# Altium schematic sheet Charger.SchDoc
size B; DocumentNumber: 9; SheetNumber: 9; SheetTotal: 9
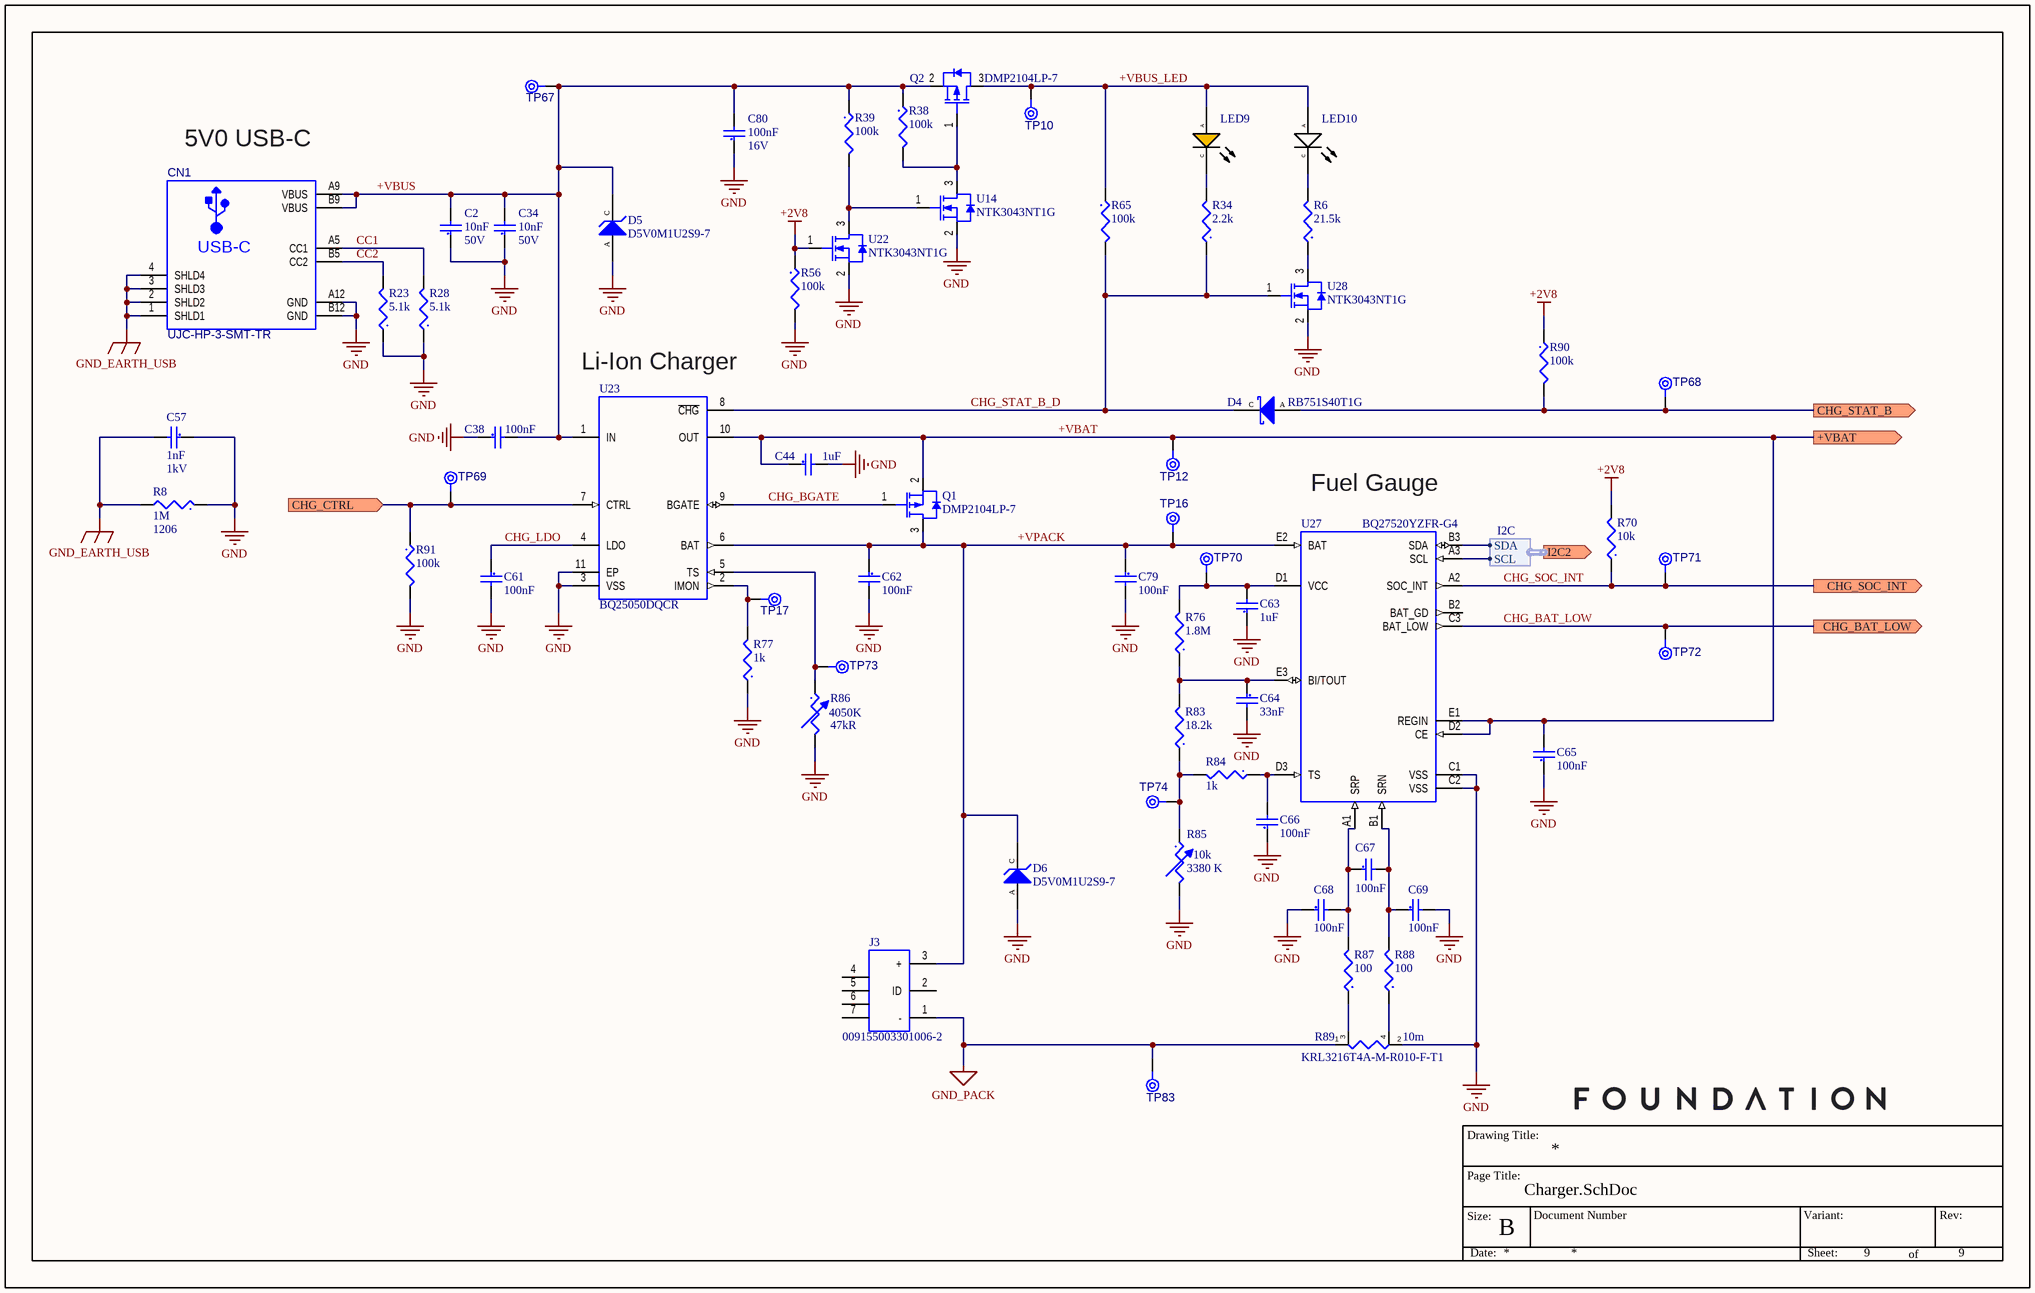
[diagram p0: Charger.SchDoc]

## Parts
C2  Capacitance: 10nF  Voltage: 50V  [CAPC0402(1005)55_L]  (hidden comment: CAP CER 0.01uF 50V 10% X7R 0402)
C34  Capacitance: 10nF  Voltage: 50V  [CAPC0402(1005)55_L]  (hidden comment: CAP CER 0.01uF 50V 10% X7R 0402)
C38  Capacitance: 100nF  [CAPC0402(1005)55_L]  (hidden comment: CAP CER 0.1uF 16V 10% X7R 0402)
C44  Capacitance: 1uF  [CAPC0402(1005)55_L]  (hidden comment: CAP CER 1uF 25V 10% X5R 0402)
C57  Capacitance: 1nF  Voltage Rating (DC): 1kV  [CAPC0805(2012)145_N]  (hidden comment: CAP CER 1000pF 1000V 10% X7R 0805)
C61  Capacitance: 100nF  [CAPC0402(1005)55_L]  (hidden comment: CAP CER 0.1uF 16V 10% X7R 0402)
C62  Capacitance: 100nF  [CAPC0402(1005)55_L]  (hidden comment: CAP CER 0.1uF 16V 10% X7R 0402)
C63  Capacitance: 1uF  [CAPC0402(1005)55_L]  (hidden comment: CAP CER 1uF 25V 10% X5R 0402)
C64  Capacitance: 33nF  [CAPC0402(1005)55_L]  (hidden comment: CAP CER 0.033uF 25V 10% X7R 0402)
C65  Capacitance: 100nF  [CAPC0402(1005)55_L]  (hidden comment: CAP CER 0.1uF 16V 10% X7R 0402)
C66  Capacitance: 100nF  [CAPC0402(1005)55_L]  (hidden comment: CAP CER 0.1uF 16V 10% X7R 0402)
C67  Capacitance: 100nF  [CAPC0402(1005)55_L]  (hidden comment: CAP CER 0.1uF 16V 10% X7R 0402)
C68  Capacitance: 100nF  [CAPC0402(1005)55_L]  (hidden comment: CAP CER 0.1uF 16V 10% X7R 0402)
C69  Capacitance: 100nF  [CAPC0402(1005)55_L]  (hidden comment: CAP CER 0.1uF 16V 10% X7R 0402)
C79  Capacitance: 100nF  [CAPC0402(1005)55_L]  (hidden comment: CAP CER 0.1uF 16V 10% X7R 0402)
C80  Capacitance: 100nF  Voltage: 16V  [CAPC0402(1005)55_L]  (hidden comment: CAP CER 0.1uF 16V 10% X7R 0402)
CN1  UJC-HP-3-SMT-TR  [CUI - UJC-HP-3-SMT_V]
D4  RB751S40T1G  [ON - SOD-523_V]
D5  D5V0M1U2S9-7  [DIOD - SOD-923_V]
D6  D5V0M1U2S9-7  [DIOD - SOD-923_V]
J3  009155003301006-2  [AVX - 009155003301006_V]
LED9  IN-S63AT5A  [LEDC0603(1608)65_L]  (value not drawn)
LED10  IN-S63AT5UW  [LEDC0603(1608)65_L]  (value not drawn)
Q1  DMP2104LP-7  [DIOD - XDFN-3_V]
Q2  DMP2104LP-7  [DIOD - XDFN-3_V]
R6  Resistance: 21.5k  [RESC0402(1005)_L]  (hidden comment: RES 21.5K 1/16W 1% 0402)
R8  Resistance: 1M  Case Code (Imperial): 1206  [RESC1206(3216)_L]  (hidden comment: RES 1.0M 1/4W 5% 1206)
R23  Resistance: 5.1k  [RESC0402(1005)_L]  (hidden comment: RES 5.1K 1/16W 1% 0402)
R28  Resistance: 5.1k  [RESC0402(1005)_L]  (hidden comment: RES 5.1K 1/16W 1% 0402)
R34  Resistance: 2.2k  [RESC0402(1005)_L]  (hidden comment: RES 2.2K 1/16W 1% 0402)
R38  Resistance: 100k  [RESC0402(1005)_L]  (hidden comment: RES 100K 1/16W 1% 0402)
R39  Resistance: 100k  [RESC0402(1005)_L]  (hidden comment: RES 100K 1/16W 1% 0402)
R56  Resistance: 100k  [RESC0402(1005)_L]  (hidden comment: RES 100K 1/16W 1% 0402)
R65  Resistance: 100k  [RESC0402(1005)_L]  (hidden comment: RES 100K 1/16W 1% 0402)
R70  Resistance: 10k  [RESC0402(1005)_L]  (hidden comment: RES 10K 1/16W 1% 0402)
R76  Resistance: 1.8M  [RESC0402(1005)_L]  (hidden comment: RES 1.8M 1/16W 1% 0402)
R77  Resistance: 1k  [RESC0402(1005)_L]  (hidden comment: RES 1.0K 1/16W 1% 0402)
R83  Resistance: 18.2k  [RESC0402(1005)_L]  (hidden comment: RES 18.2K 1/16W 1% 0402)
R84  Resistance: 1k  [RESC0402(1005)_L]  (hidden comment: RES 1.0K 1/16W 1% 0402)
R85  Resistance: 10k  B Constant [25/50°C]: 3380 K  [RESC0402(1005)_L]  (hidden comment: NTCG103JF103FT1)
R86  Resistance: 47kR  B Constant [25/50°C]: 4050K  [RESC0402(1005)_L]  (hidden comment: NCP15WB473F03RC)
R87  Resistance: 100  [RESC0402(1005)_L]  (hidden comment: RES 100 OHM 1/16W 1% 0402)
R88  Resistance: 100  [RESC0402(1005)_L]  (hidden comment: RES 100 OHM 1/16W 1% 0402)
R89  KRL3216T4A-M-R010-F-T1  Resistance: 10m  [Susumu - KRL3216T4A_V]
R90  Resistance: 100k  [RESC0402(1005)_L]  (hidden comment: RES 100K 1/16W 1% 0402)
R91  Resistance: 100k  [RESC0402(1005)_L]  (hidden comment: RES 100K 1/16W 1% 0402)
TP10  TPAD8R  [TP08R]  (value not drawn)  (no BOM)
TP12  TPAD8R  [TP08R]  (value not drawn)  (no BOM)
TP16  TPAD8R  [TP08R]  (value not drawn)  (no BOM)
TP17  TPAD8R  [TP08R]  (value not drawn)  (no BOM)
TP67  TPAD8R  [TP08R]  (value not drawn)  (no BOM)
TP68  TPAD8R  [TP08R]  (value not drawn)  (no BOM)
TP69  TPAD8R  [TP08R]  (value not drawn)  (no BOM)
TP70  TPAD8R  [TP08R]  (value not drawn)  (no BOM)
TP71  TPAD8R  [TP08R]  (value not drawn)  (no BOM)
TP72  TPAD8R  [TP08R]  (value not drawn)  (no BOM)
TP73  TPAD8R  [TP08R]  (value not drawn)  (no BOM)
TP74  TPAD8R  [TP08R]  (value not drawn)  (no BOM)
TP83  TPAD8R  [TP08R]  (value not drawn)  (no BOM)
U14  NTK3043NT1G  [SOT-723-3(40)_N]
U22  NTK3043NT1G  [SOT-723-3(40)_N]
U23  BQ25050DQCR  [TI - WSON-DQC-10_V]
U27  BQ27520YZFR-G4  [TI - DSBGA-YZF-15_V]
U28  NTK3043NT1G  [SOT-723-3(40)_N]

## Ports
+VBAT (out), CHG_BAT_LOW (out), CHG_CTRL (in), CHG_SOC_INT (out), CHG_STAT_B (out), I2C2 (out, harness I2C)

## Harnesses
I2C: SDA, SCL

## Nets
+2V8: R56.1 R70.2 R90.1 U22.1(G)
GND: C2.1 C34.1 C38.1 C44.2 C57.1 C61.2 C62.2 C63.1 C64.2 C65.1 C66.1 C68.1 C69.2 C79.2 C80.1 CN1.A12(GND) CN1.B12(GND) D5.A D6.A R8.1 R23.1 R28.1 R56.2 R77.1 R85.2 R86.2 R89.2(I2) R91.2 U14.2(S) U22.2(S) U23.3(VSS) U23.11(EP) U27.C1(VSS) U27.C2(VSS) U28.2(S)
GND_EARTH_USB: C57.2 CN1.1(SHLD1) CN1.2(SHLD2) CN1.3(SHLD3) CN1.4(SHLD4) R8.2
GND_PACK: J3.1(-) R89.1(I1) TP83.1(TP)
+VBAT: C44.1 C65.2 Q1.2(SOURCE) TP12.1(TP) U23.10(OUT) U27.D2(CE) U27.E1(REGIN) ; port +VBAT
+VBUS: C2.2 C34.2 C38.2 C80.2 CN1.A9(VBUS) CN1.B9(VBUS) D5.C Q2.2(SOURCE) R38.1 R39.1 TP67.1(TP) U23.1(IN)
+VBUS_LED: LED9.A LED10.A Q2.3(DRAIN) R65.1 TP10.1(TP)
+VPACK: C62.1 C79.1 D6.C J3.3(+) Q1.3(DRAIN) TP16.1(TP) U23.6(BAT) U27.E2(BAT)
CC1: CN1.A5(CC1) R28.2
CC2: CN1.B5(CC2) R23.2
CHG_BAT_LOW: TP72.1(TP) U27.C3(BAT_LOW) ; port CHG_BAT_LOW
CHG_BGATE: Q1.1(GATE) U23.9(BGATE)
CHG_CTRL: R91.1 TP69.1(TP) U23.7(CTRL) ; port CHG_CTRL
CHG_LDO: C61.1 U23.4(LDO)
CHG_SOC_INT: R70.1 TP71.1(TP) U27.A2(SOC_INT) ; port CHG_SOC_INT
CHG_STAT_B: D4.A R90.2 TP68.1(TP) ; port CHG_STAT_B
CHG_STAT_B_D: D4.C R34.1 R65.2 U23.8(~{CHG}) U28.1(G)
NetC63_2: C63.2 R76.2 TP70.1(TP) U27.D1(VCC)
NetC64_1: C64.1 R76.1 R83.2 U27.E3(BI/TOUT)
NetC66_2: C66.2 R84.1 U27.D3(TS)
NetC67_1: C67.1 C68.2 R87.2 U27.A1(SRP)
NetC67_2: C67.2 C69.1 R88.2 U27.B1(SRN)
NetLED9_C: LED9.C R34.2
NetLED10_C: LED10.C R6.2
NetQ2_1: Q2.1(GATE) R38.2 U14.3(D)
NetR6_1: R6.1 U28.3(D)
NetR39_2: R39.2 U14.1(G) U22.3(D)
NetR77_2: R77.2 TP17.1(TP) U23.2(IMON)
NetR83_1: R83.1 R84.2 R85.1 TP74.1(TP)
NetR86_1: R86.1 TP73.1(TP) U23.5(TS)
NetR87_1: R87.1 R89.3(E1)
NetR88_1: R88.1 R89.4(E2)
NetU27_A3: U27.A3(SCL) ; port I2C2.SCL
NetU27_B3: U27.B3(SDA) ; port I2C2.SDA

Not connected (* = marked no-connect by the designer): J3 2(ID) 4 5 6 7; U27 B2(BAT_GD)

## Notes on the sheet
- (near CN1) 5V0 USB-C
- (near U23) Li-Ion Charger
- Fuel Gauge
- Drawing Title:
- Page Title:
- Size:
- B
- Document Number
- Variant:
- Rev:
- Date:
- Sheet:
- of
- (in symbol CMP-CON-0075-1) USB-C

## Library data of the parts
C2 C34 = CMP-CAP-00023-2: 10000pF ±10% 50V Ceramic Capacitor X7R 0402 (1005 Metric); Voltage Rating: 50V; Contact Plating: Tin,Matte; Packaging: Tape and Reel; Depth: 0.5mm; Mount: Surface Mount; Dielectric: X7R; Min Operating Temperature: -55°C; Case/Package: 0402; Tolerance: 10%; Dielectric Material: Ceramic; Termination: SMD/SMT; Radiation Hardening: No; Height: 0.5mm; Max Operating Temperature: 125°C; Length: 1mm
C38 C61 C62 C65-C69 C79 C80 = CMP-CAP-00002-2: 0.1µF ±10% 16V Ceramic Capacitor X7R 0402 (1005 Metric); Insulation Resistance: 10GR; Material: Ceramic; Tolerance: 10%; REACH SVHC: No SVHC; Radiation Hardening: No; Case Code (Metric): 1005; Height: 0.5mm; Depth: 0.5mm; Min Operating Temperature: -55°C; Max Operating Temperature: 125°C; Lead Free: Lead Free; Thickness: 0.022inch; Length: 1mm; Voltage Rating (DC): 16V; Dielectric Material: Ceramic; Packaging: Tape and Reel; Case/Package: 0402; Width: 0.5mm; Termination: SMD/SMT; Voltage Rating: 16V; Mount: Surface Mount; Case Code (Imperial): 0402; Package Quantity: 1; Dielectric: X7R; Number of Pins: 2
  C38 C61 C62 C65-C69 C79: Voltage: 16V
C44 C63 = CMP-CAP-00053-2: 1uF ±10% 25V Ceramic Capacitor X5R 0402 (1005 Metric); Number of Terminals/Pins: 2; Multilayer: Yes; Width: 0.5mm; Height: 0.6mm; Termination: Wraparound; Dielectric Material: Ceramic; Min Operating Temperature: -55°C; Mount: Surface Mount; Length: 1mm; Capacitor Type: Ceramic; Max Operating Temperature: 85°C; Packaging: Tape and Reel; Negative Tolerance: 10%; Package Style: SMTMeter; Package Shape: Rectangular; Size Code: 0402; Rated DC Voltage (URdc): 25V; Terminal Finish: Nickel; Positive Tolerance: 10%; JESD-609 Code: e3; Temperature Characteristics Code: X5R
C57 = CMP-CAP-00004-1: 1000pF ±10% 1000V (1kV) Ceramic Capacitor X7R 0805 (2012 Metric); Insulation Resistance: 100GR; Mount: Surface Mount; Width: 1.25mm; Voltage Rating: 1kV; Number of Pins: 2; Packaging: Tape and Reel; Package Quantity: 4000; Termination: SMD/SMT; Height: 1.3mm; Case Code (Metric): 2012; Depth: 1.25mm; Dielectric: X7R; Thickness: 0.051inch; Length: 2.01mm; Case Code (Imperial): 0805; Contact Plating: Nickel,Tin,Matte; Dissipation Factor: 10%; Tolerance: 10%; Case/Package: 0805; Min Operating Temperature: -55°C; REACH SVHC: No SVHC; Lead Free: Lead Free; Dielectric Material: Ceramic; Max Operating Temperature: 125°C
C64 = CMP-CAP-00072-1: 0.033µF ±10% 25V Ceramic Capacitor X7R 0402 (1005 Metric); Manufacturer Series: C0402C333K3RACTU; Multilayer: Yes; Number of Terminals/Pins: 2; Positive Tolerance: 10%; Width: 0.5mm; Mount: Surface Mount; Max Operating Temperature: 125°C; JESD-609 Code: e3; Termination: Wraparound; Min Operating Temperature: -55°C; Package Style: SMTMeter; Terminal Finish: Nickel; Length: 1mm; Rated DC Voltage (URdc): 25V; Series: C(SIZE)C(X7R); Size Code: 0402; Packaging: Tape and Reel; REACH SVHC: Yes; Package Shape: Rectangular; Negative Tolerance: 10%; Temperature Characteristics Code: X7R; Height: 0.5mm; RoHS Compliant: Yes; Capacitor Type: Ceramic; Dielectric Material: Ceramic
CN1 = CMP-CON-0075-1: USB-C (USB TYPE-C) - Receptacle Connector 24 (6+18 Dummy) Position Surface Mount, Right Angle; Through Hole; ComponentLink1Description: Datasheet; ComponentLink1URL: https://www.cuidevices.com/product/resource/ujc-hp-3-smt-tr.pdf
D4 = CMP-DIO-0007-1: Diode Schottky 30V 30mA (DC) Surface Mount SOD-523; Voltage Rating (DC): 40V; Peak Non-Repetitive Surge Current: 500mA; Peak Reverse Current: 500nA; Element Configuration: Single; Capacitance: 2.5pF; Power Dissipation: 200mW; Polarity: Standard; Forward Voltage: 370mV; Radiation Hardening: No; Min Operating Temperature: -55°C; Current Rating: 30mA; Forward Current: 30mA; Number of Pins: 2; Average Rectified Current: 30mA; Output Current: 30mA; Max Operating Temperature: 150°C; Width: 0.9mm; ComponentLink1Description: Datasheet; Length: 1.3mm; Max Surge Current: 500mA; Max Reverse Voltage (DC): 30V; REACH SVHC: No SVHC; Lead Free: Lead Free; Max Reverse Leakage Current: 500nA; Max Forward Surge Current (Ifsm): 500mA; Package Quantity: 1; ComponentLink1URL: https://www.onsemi.cn/PowerSolutions/document/RB751S40T1-D.PDF; Max Repetitive Reverse Voltage (Vrrm): 40V; Contact Plating: Tin,Matte; Case/Package: SOD-523-2; Height: 0.7mm; Packaging: Tape and Reel
D5 D6 = CMP-DIO-0013-1: 12V Clamp 9A (8/20µs) Ipp Tvs Diode Surface Mount SOD-923; Polarity: Unidirectional; Diode Element Material: SILICON; Min Breakdown Voltage: 6.2V; Number of Terminals/Pins: 2; Max Power Dissipation: 250mW; Package Body Material: Plastic; Diode Type: TRANS VOLTAGE SUPPRESSOR; Number of Elements: 1; Non-rep Peak Rev Power Dis-Max: 108W; Rep Pk Reverse Voltage-Max: 5.5V; RoHS Compliant: Yes; ComponentLink1Description: Datasheet; ComponentLink1URL: https://www.diodes.com/assets/Datasheets/D5V0M1U2S9.pdf; Technology: AVALANCHE; Package Shape: Rectangular; Surface Mount: Yes; JESD-30 Code: R-PDSO-F2; Package Style: SMALL OUTLINEMeter; Terminal Position: DUAL; Min Operating Temperature: -65°C; Max Operating Temperature: 150°C; REACH SVHC: Yes; Terminal Form: Flat
J3 = CMP-CON-0077-1: 3 Position Spring Battery Contact Connector Surface Mount, Right Angle; Manufacturer Series: 9155; MIL Conformance: No; Option: General Purpose; Connector Type: PCB; ComponentLink1URL: https://datasheets.avx.com/RightAngle3.0mmPictch_9155-300.pdf; JESD-609 Code: e3; IEC Conformance: No; REACH SVHC: Yes; DIN Conformance: No; ComponentLink1Description: Datasheet; Contact Finish - Mating: GOLD (16); RoHS Compliant: Yes; Contact Finish - Termination: PURE TIN
LED9 = CMP-007-00047-1: Amber 605nm LED Indication - Discrete 1.9V 0603 (1608 Metric); Forward Voltage: 1.9V; Colour: Amber; ComponentLink1Description: Datasheet; ComponentLink1URL: http://www.inolux-corp.com/datasheet/SMDLED/Mono%20Color%20Top%20View/IN-S63AT%20Series_V1.1.pdf
LED10 = CMP-007-00044-5: White - LED Indication - Discrete 3V 0603 (1608 Metric); Test Current: 5mA; Viewing Angle: 120°; Lens Transparency: Clear; Lens Style: Flat; Luminous Intensity: 900mcd; Lens Size: 0.8mm; Case/Package: 0603; Forward Voltage: 3V; Mount: Surface Mount; Length: 1.6mm; Height: 0.4mm; Width: 0.8mm; Color: White; Packaging: Tape and Reel; Lens Color: Clear; Case Code (Imperial): 0603; Case Code (Metric): 1608; ComponentLink1URL: http://www.inolux-corp.com/datasheet/SMDLED/Mono%20Color%20Top%20View/IN-S63AT%20Series_V1.1.pdf; ComponentLink1Description: Datasheet
Q1 Q2 = CMP-TRNST-0008-1: P-Channel 20 V 1.5A (Ta) 500mW (Ta) Surface Mount 3-DFN1411 (1.4x1.1); Transistor Application: SWITCHING; Number of Elements: 1; Transistor Element Material: SILICON; Operating Mode: ENHANCEMENT MODE; Package Body Material: Plastic; FET Technology: METAL-OXIDE SEMICONDUCTOR; Drain-source On Resistance-Max: 150mR; Time @ Peak Reflow Temperature-Max (s): 40s; Additional Feature: HIGH RELIABILITY; DS Breakdown Voltage-Min: 20V; Number of Terminals/Pins: 3; Case Connection: DRAIN; Qualification Status: Not Qualified; Max Operating Temperature: 150°C; ComponentLink1Description: Datasheet; RoHS Compliant: Yes; ComponentLink1URL: https://www.diodes.com/assets/Datasheets/ds31091.pdf; Terminal Position: BOTTOM; Surface Mount: Yes; Package Style: CHIP CARRIERMeter; JESD-609 Code: e4; Moisture Sensitivity Level: 1; Terminal Form: No Lead; Drain Current-Max (Abs) (ID): 1.5A; Power Dissipation-Max (Abs): 500mW; Polarity/Channel Type: P-CHANNEL; Drain Current-Max (ID): 1.5A; Terminal Finish: Nickel; Peak Reflow Temperature (Cel): 260°C; REACH SVHC: Yes; Package Shape: Rectangular
R6 = CMP-RES-00073-1: 21.5 kOhms ±1% 0.063W, 1/16W Chip Resistor 0402 (1005 Metric); Temperature Coefficient: 100ppm/°C; Voltage Rating: 50V; Number of Terminals/Pins: 2; Reference Standard: AEC-Q200; Rated Temperature: 70°C; Package Height: 0.35mm; Rated Power Dissipation (P): 63mW; Package Width: 0.5mm; Package Length: 1mm; Termination: Wraparound; Max Operating Temperature: 155°C; Min Operating Temperature: -55°C; Packaging: Tape and Reel; Tolerance: 1%; Mount: Surface Mount; Working Voltage: 50V; Construction: Chip; Resistor Type: FIXED RESISTOR; Technology: METAL GLAZE/THICK FILM; JESD-609 Code: e3; Size Code: 0402; Terminal Finish: Nickel; Package Style: SMTMeter; Package Shape: Rectangular
R8 = CMP-RES-00004-3: 1 MOhms ±5% 0.25W, 1/4W Chip Resistor 1206 (3216 Metric) Moisture Resistant Thick Film; Power Rating: 250mW; Temperature Coefficient: 200ppm/°C; Voltage Rating: 200V; Mount: Surface Mount; Radiation Hardening: No; Tolerance: 5%; Military Standard: Not; Termination: SMD/SMT; Case Code (Metric): 3216; Depth: 1.6mm; Case/Package: 1206; REACH SVHC: No SVHC; Height: 0.6mm; Max Operating Temperature: 155°C; Package Quantity: 5000; Thickness: 610um; Min Operating Temperature: -55°C; Voltage Rating (DC): 200V; Length: 3.2mm; Composition: Thick Film; Width: 1.6mm; Packaging: Tape and Reel; Contact Plating: Tin
R23 R28 = CMP-RES-00060-1: 5.1 kOhms ±1% 0.063W, 1/16W Chip Resistor 0402 (1005 Metric); Voltage Rating (DC): 50V; Temperature Coefficient: 100ppm/°C; Power Rating: 63mW; Min Operating Temperature: -55°C; Packaging: Tape and Reel; Package Quantity: 10; REACH SVHC: Unknown; Number of Terminations: 2; Termination: SMD/SMT; Composition: Thick Film; Length: 1mm; Case Code (Imperial): 0402; Weight: 2.3E-05oz; Lead Free: Lead Free; Max Operating Temperature: 155°C; Voltage Rating: 50V; Contact Plating: Tin; Radiation Hardening: No; Case Code (Metric): 1005; Height: 0.35mm; Tolerance: 1%; Depth: 0.5mm; Military Standard: Not; Width: 0.02inch; Max Power Dissipation: 63mW; Case/Package: 0402; Features: Automotive AEC-Q200
R34 = CMP-RES-00049-1: 2.2 kOhms ±1% 0.063W, 1/16W Chip Resistor 0402 (1005 Metric); Temperature Coefficient: 100ppm/°C; Voltage Rating: 50V; Power Rating: 63mW; Termination: SMD/SMT; Max Operating Temperature: 155°C; Height: 0.35mm; Length: 1mm; Case Code (Metric): 1005; REACH SVHC: Unknown; Case/Package: 0402; Weight: 2.3E-05oz; Composition: Thick Film; Min Operating Temperature: -55°C; Width: 0.5mm; Military Standard: Not; Case Code (Imperial): 0402; Depth: 0.5mm; Packaging: Tape and Reel; Lead Free: Lead Free; Tolerance: 1%
R38 R39 R56 R65 R90 R91 = CMP-RES-00003-3: 100 kOhms ±1% 0.063W, 1/16W Chip Resistor 0402 (1005 Metric) Automotive AEC-Q200 Thick Film; Temperature Coefficient: 100ppm/°C; Voltage Rating (DC): 50V; Max Power Dissipation: 63mW; Number of Terminations: 2; Case/Package: 0402; Length: 1mm; Military Standard: Not; Mount: Surface Mount; Termination: SMD/SMT; Radiation Hardening: No; Package Quantity: 10000; Case Code (Metric): 1005; Case Code (Imperial): 0402; REACH SVHC: Unknown; Depth: 0.5mm; Features: Automotive AEC-Q200; Voltage Rating: 50V; Min Operating Temperature: -55°C; Lead Free: Lead Free; Power Rating: 63mW; Number of Pins: 2; Max Operating Temperature: 155°C; Contact Plating: Tin; Weight: 2.3E-05oz; Packaging: Tape and Reel; Tolerance: 1%; Height: 0.35mm; Composition: Thick Film; Width: 0.02inch
R70 = CMP-RES-00006-3: 10 kOhms ±1% 0.063W, 1/16W Chip Resistor 0402 (1005 Metric); Max Power Dissipation: 63mW; Voltage Rating (DC): 50V; Temperature Coefficient: 100ppm/°C; Width: 0.02inch; Power Rating: 63mW; Case/Package: 0402; Min Operating Temperature: -55°C; Number of Terminations: 2; Lead Free: Lead Free; Features: Automotive AEC-Q200; Number of Pins: 2; Tolerance: 1%; Height: 0.35mm; Mount: Surface Mount; Radiation Hardening: No; Length: 1mm; Case Code (Metric): 1005; Weight: 2.3E-05oz; Military Standard: Not; Depth: 0.5mm; Package Quantity: 10; Max Operating Temperature: 155°C; Termination: SMD/SMT; Case Code (Imperial): 0402; Contact Plating: Tin; Voltage Rating: 50V; Composition: Thick Film; Packaging: Tape and Reel; REACH SVHC: Unknown
R76 = CMP-RES-00016-4: 1.8 MOhms ±1% 0.063W, 1/16W Chip Resistor 0402 (1005 Metric); Temperature Coefficient: 100ppm/°C; Voltage Rating: 50V; Power Rating: 63mW; Military Standard: Not; Case/Package: 0402; Depth: 0.5mm; Mount: Surface Mount; Case Code (Imperial): 0402; Height: 0.35mm; Case Code (Metric): 1005; Radiation Hardening: No; Number of Pins: 2; Composition: Thick Film; Length: 1mm; Termination: SMD/SMT; Lead Free: Lead Free; Package Quantity: 10000; Width: 0.5mm; REACH SVHC: Unknown; Min Operating Temperature: -55°C; Voltage Rating (DC): 50V; Weight: 2.3E-05oz; Packaging: Tape and Reel; Max Operating Temperature: 155°C; Tolerance: 1%; Contact Plating: Tin
R77 R84 = CMP-RES-00000-3: 1 kOhms ±0.5% 0.063W, 1/16W Chip Resistor 0402 (1005 Metric) Automotive AEC-Q200 Thin Film; Voltage Rating: 25V; Power Rating: 62.5mW; Temperature Coefficient: 25ppm/°C; Max Power Dissipation: 63mW; Min Operating Temperature: -55°C; Radiation Hardening: No; Mount: Surface Mount; Tolerance: 0.5%; Height: 0.016inch; Military Standard: Not; Lead Free: Lead Free; Depth: 0.5mm; Package Quantity: 10000; Max Operating Temperature: 155°C; Weight: 2.8E-05oz; Case Code (Imperial): 0402; Number of Terminations: 2; Case Code (Metric): 1005; Termination: SMD/SMT; Packaging: Tape and Reel; Case/Package: 0402; Voltage Rating (DC): 25V; REACH SVHC: No SVHC; Width: 0.5mm; Length: 1mm; Contact Plating: Tin; Composition: Metal Film,Thin Film
R83 = CMP-RES-00026-3: 18.2 kOhms ±1% 0.063W, 1/16W Chip Resistor 0402 (1005 Metric); Power Rating: 63mW; Voltage Rating: 50V; Temperature Coefficient: 100ppm/°C; Mount: Surface Mount; Termination: SMD/SMT; Packaging: Tape and Reel; Military Standard: Not; Max Operating Temperature: 155°C; Height: 0.35mm; Case Code (Imperial): 0402; Lead Free: Lead Free; Min Operating Temperature: -55°C; Radiation Hardening: No; Weight: 2.3E-05oz; Case/Package: 0402; Package Quantity: 10; Number of Terminations: 2; Features: Automotive AEC-Q200; Tolerance: 1%; Depth: 0.5mm; REACH SVHC: Unknown; Case Code (Metric): 1005; Length: 1mm; Width: 0.02inch; Max Power Dissipation: 63mW; Number of Pins: 2; Voltage Rating (DC): 50V; Contact Plating: Tin; Composition: Thick Film
R85 = CMP-SEN-0009-2: NTC Thermistor 10k 0402 (1005 Metric)
R86 = CMP-SEN-0016-1: NTC Thermistor 47k 0402 (1005 Metric); Manufacturer Series: NCP; Rated Power Dissipation (P): 100mW; Tolerance: 1%; Rated Temperature: 25°C; Number of Terminals/Pins: 2; Thermistor Application: TEMPERATURE COMPENSATION; ComponentLink1URL: https://www.murata.com/~/media/webrenewal/support/library/catalog/products/thermistor/ntc/r44e.ashx?la=en-us; Max Operating Temperature: 125°C; Resistor Type: NTC THERMISTOR; Package Shape: Rectangular; Terminal Finish: Nickel; Mount: Surface Mount; JESD-609 Code: e3; Terminal Placement: Dual Ended; REACH SVHC: Yes; Packaging: Tape and Reel; ComponentLink1Description: Datasheet; Min Operating Temperature: -40°C; Termination: Wraparound; RoHS Compliant: Yes
R87 R88 = CMP-RES-00056-1: 100 Ohms ±1% 0.063W, 1/16W Chip Resistor 0402 (1005 Metric)  Thick Film; Working Voltage: 50V; Temperature Coefficient: 100ppm/°C; Max Power Dissipation: 63mW; Military Standard: Not; Number of Terminations: 2; Tolerance: 1%; Mount: Surface Mount; Voltage Rating (DC): 50V; Lead Free: Lead Free; Features: Automotive AEC-Q200; Voltage Rating: 50V; Height: 0.35mm; Termination: SMD/SMT; Max Operating Temperature: 155°C; Case Code (Imperial): 0402; Length: 1mm; Width: 0.02inch; Composition: Thick Film; Weight: 2.3E-05oz; Packaging: Tape and Reel; Case/Package: 0402; REACH SVHC: Unknown; Radiation Hardening: No; Contact Plating: Tin; Package Quantity: 10; Depth: 0.5mm; Min Operating Temperature: -55°C; Power Rating: 63mW; Case Code (Metric): 1005
R89 = CMP-RES-00084-2: Fixed Resistor, Metal Foil, 1W, 0.01ohm, 1% +/-Tol, 35ppm/Cel, Surface Mount, 1206; Voltage Rating: 50V; Package Length: 3.2mm; Rated Temperature: 70°C; Package Height: 0.5mm; Number of Terminals/Pins: 4; Reference Standard: AEC-Q200; Temperature Coefficient: 50ppm/°C; Package Width: 1.6mm; Size Code: 1206; Rated Power Dissipation (P): 1W; ComponentLink1URL: https://www.susumu.co.jp/common/pdf/n_catalog_partition20_en.pdf; ComponentLink1Description: Datasheet; Packaging: Tape and Reel; Package Style: SMTMeter; Tolerance: 1%; Max Operating Temperature: 155°C; JESD-609 Code: e3; REACH SVHC: Yes; Mount: Surface Mount; Termination: One Surface; Construction: Rectangular; Technology: METAL FOIL; RoHS Compliant: Yes; Min Operating Temperature: -55°C; Terminal Finish: Tin; Resistor Type: FIXED RESISTOR
TP10 TP12 TP16 TP17 TP67-TP74 TP83 = CMP-MECH-00011-2: 0.8mm round; Pins: 1
U14 U22 U28 = CMP-TRNST-0003-1: N-Channel 20V 210mA (Ta) 310mW (Ta) Surface Mount SOT-723; Power Dissipation: 440mW; Gate to Source Voltage (Vgs): 10V; Drain to Source Resistance: 3.4R; Input Capacitance: 11pF; Turn-On Delay Time: 13ns; Vgs(th) (Max) @ Id: 1.3V @ 250µA; Turn-Off Delay Time: 94ns; Rise Time: 15ns; Number of Elements: 1; Element Configuration: Single; Current Rating: 225mA; Threshold Voltage: 400mV; Max Operating Temperature: 150°C; Package Quantity: 1; Packaging: Tape and Reel; Continuous Drain Current (ID): 210mA; Pins: 3; Min Operating Temperature: -55°C; Vgs (Max): 10V; Drain to Source Breakdown Voltage: 20V; Radiation Hardening: No; Mounting Technology: Surface Mount; Drain to Source Voltage (Vdss): 20V; Number of Pins: 3; Max Power Dissipation: 310mW; Fall Time: 15ns; Case/Package: SOT-723-3; Transistor Type: N-Channel; Rds On Max: 3.4R; Lead Free: Lead Free; Height: 0.55mm; Contact Plating: Tin,Matte; On-State Resistance: 3.4R; Length: 1.25mm; REACH SVHC: No SVHC; Width: 0.85mm; Voltage Rating (DC): 20V
U23 = CMP-PMIC-00058-2: Charger IC Lithium Ion 10-WSON (3x2); Package Body Material: Plastic; Adjustable Threshold: Yes; Supply Voltage-Min (Vsup): 3.55V; Number of Functions: 1; Analog IC - Other Type: POWER SUPPLY SUPPORT CIRCUIT; Number of Channels: 2; Supply Voltage-Nom (Vsup): 5V; Supply Voltage-Max (Vsup): 28V; Number of Terminals/Pins: 10; Qualification Status: Not Qualified; Terminal Position: DUAL; REACH SVHC: Yes; Package Code: HVSON; JESD-609 Code: e4; Temperature Grade: INDUSTRIAL; Max Operating Temperature: 85°C; Terminal Finish: Nickel; Length: 3mm; Package Style: SMALL OUTLINE, HEAT SINK/SLUG, VERY THIN PROFILEMeter; Surface Mount: Yes; Package Shape: Rectangular; Terminal Form: No Lead; Height - Seated (Max): 0.8mm; Peak Reflow Temperature (Cel): 260°C; Width: 2mm; RoHS Compliant: Yes; Min Operating Temperature: -40°C; Terminal Pitch: 0.5mm; Moisture Sensitivity Level: 2; ComponentLink1Description: Datasheet; ComponentLink1URL: https://www.ti.com/lit/ds/symlink/bq25050.pdf?ts=1629767592474&ref_url=https%253A%252F%252Fwww.ti.com%252Fproduct%252FBQ25050%253FkeyMatch%253DBQ25050%2526tisearch%253Dsearch-everything%2526usecase%253DGPN
U27 = CMP-PMIC-00059-1: Battery Battery Monitor IC Lithium Ion 15-DSBGA; Number of Functions: 1; Supply Voltage-Nom (Vsup): 3.6V; Supply Voltage-Max (Vsup): 4.5V; Number of Terminals/Pins: 15; Supply Voltage-Min (Vsup): 2.8V; Qualification Status: Not Qualified; Analog IC - Other Type: POWER SUPPLY MANAGEMENT CIRCUIT; Adjustable Threshold: No; Height - Seated (Max): 0.625mm; Peak Reflow Temperature (Cel): 260°C; Min Operating Temperature: -40°C; Length: 2.61mm; RoHS Compliant: Yes; JESD-609 Code: e1; Terminal Pitch: 0.5mm; Terminal Form: Ball; Temperature Grade: INDUSTRIAL; REACH SVHC: Yes; Package Shape: Rectangular; ComponentLink1URL: https://www.ti.com/lit/ds/symlink/bq27520-g4.pdf?HQS=dis-dk-null-digikeymode-dsf-pf-null-wwe&ts=1629768663314&ref_url=https%253A%252F%252Fwww.ti.com%252Fgeneral%252Fdocs%252Fsuppproductinfo.tsp%253FdistId%253D10%2526gotoUrl%253Dhttps%253A%252F%252Fwww.ti.com%252Flit%252Fgpn%252Fbq27520-g4; Max Operating Temperature: 85°C; Power Supplies: 3.6V; Terminal Finish: Copper; Package Code: VFBGA; Package Style: GRID ARRAY, VERY THIN PROFILE, FINE PITCHMeter; Width: 1.956mm; Number of Channels: 1; Moisture Sensitivity Level: 1; ComponentLink1Description: Datasheet; Surface Mount: Yes; Terminal Position: BOTTOM